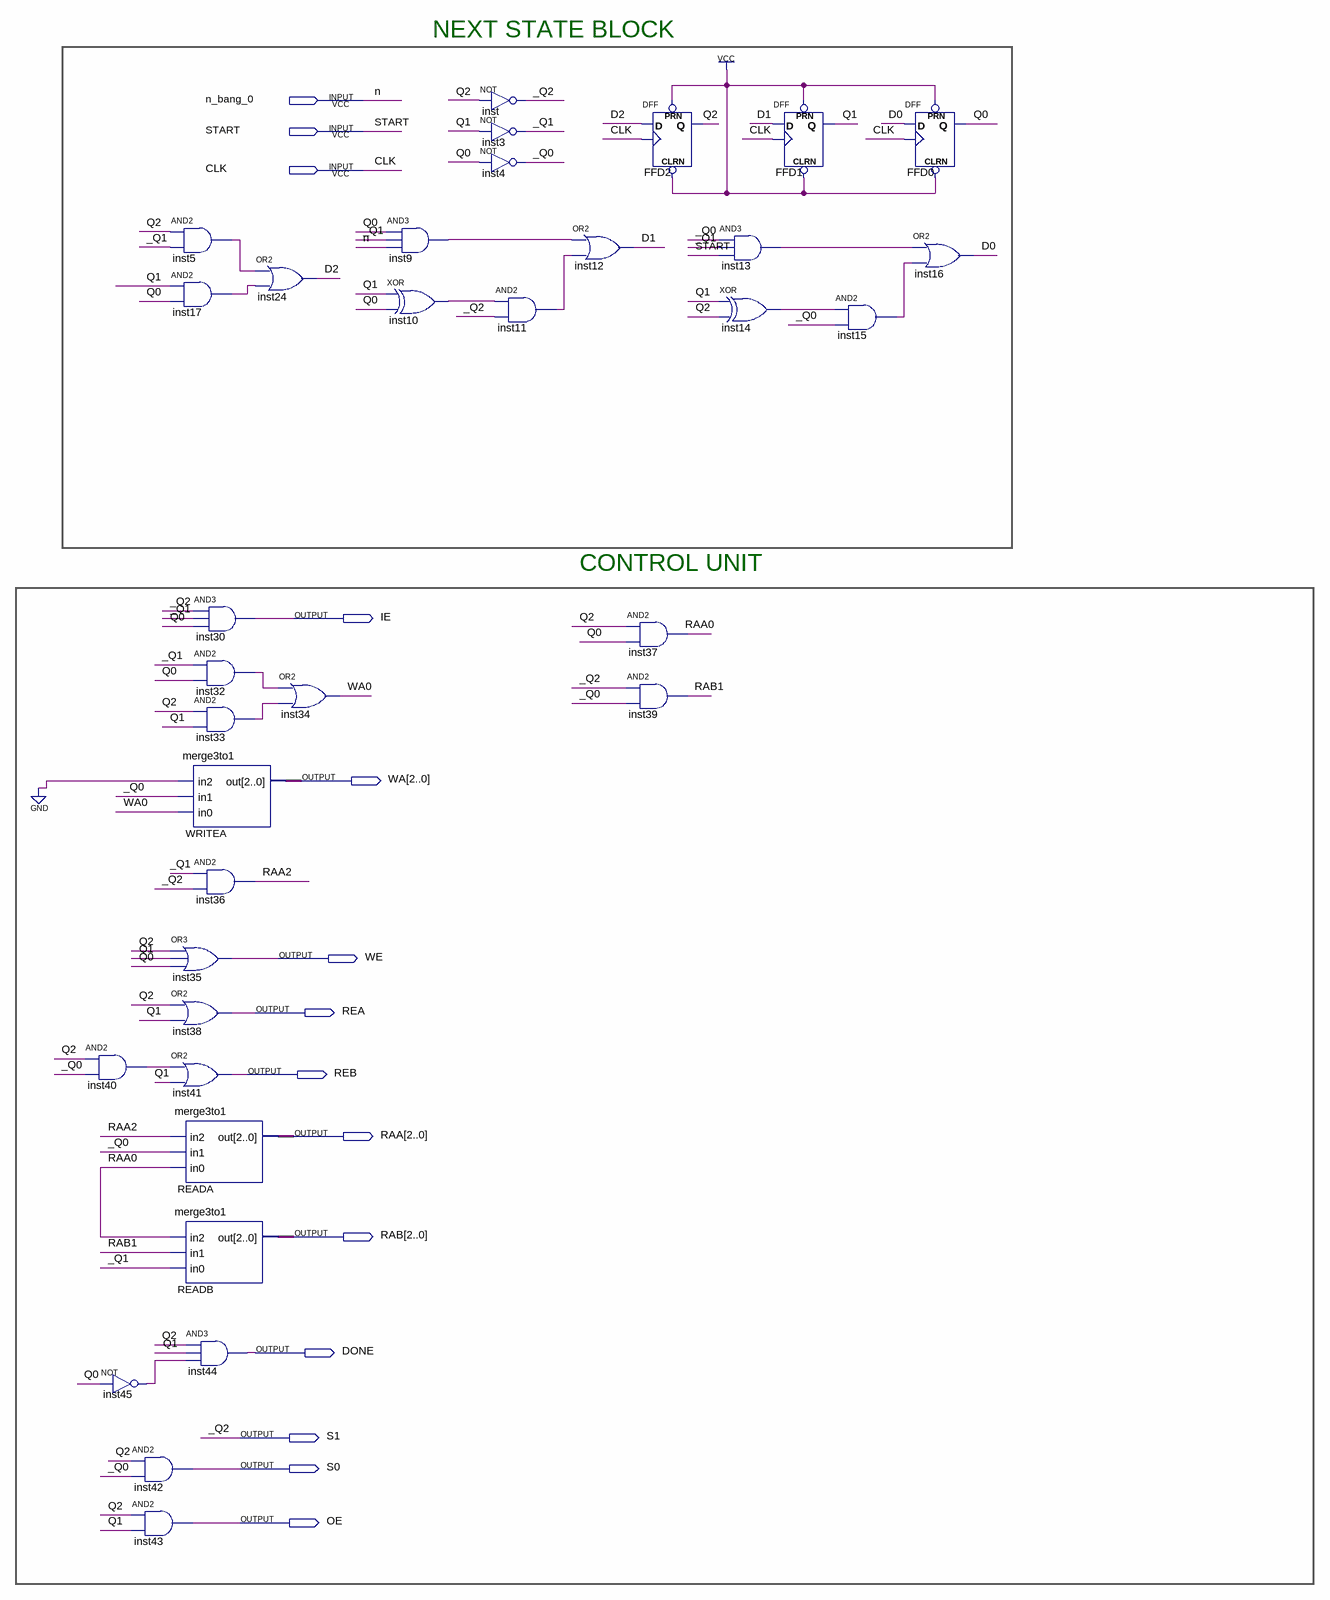
[diagram p0: schematic sheet]
// Quartus schematic NextState.bdf as structural Verilog: 35 symbols, 14 pins
module NextState (
  input  n_bang_0,
  input  START,
  input  CLK,
  output IE,
  output [2:0] WA,
  output WE,
  output REA,
  output REB,
  output [2:0] RAA,
  output [2:0] RAB,
  output DONE,
  output S1,
  output S0,
  output OE
);

  wire _Q0, _Q1, D0, D1, D2, inst5_out, inst9_out, inst10_out, inst11_out, inst13_out, inst14_out,
       inst15_out, inst17_out, inst32_out, inst33_out, inst40_out, inst45_out, Q0, Q1, Q2;

  and inst40 (inst40_out, Q2, _Q0);
  not inst45 (inst45_out, Q0);
  and inst42 (S0, Q2, _Q0);
  and inst43 (OE, Q2, Q1);
  and inst5 (inst5_out, Q2, _Q1);
  and inst17 (inst17_out, Q1, Q0);
  and inst30 (IE, S1, _Q1, Q0);
  and inst32 (inst32_out, _Q1, Q0);
  and inst33 (inst33_out, Q2, Q1);
  merge3to1 WRITEA (.in2(1'b0), .in1(_Q0), .in0(WA[0]), .out(WA));
  and inst36 (RAA[2], _Q1, S1);
  or inst35 (WE, Q2, Q1, Q0);
  or inst38 (REA, Q2, Q1);
  or inst41 (REB, inst40_out, Q1);
  merge3to1 READA (.in2(RAA[2]), .in1(_Q0), .in0(RAA[0]), .out(RAA));
  merge3to1 READB (.in2(RAA[0]), .in1(RAB[1]), .in0(_Q1), .out(RAB));
  and inst44 (DONE, Q2, Q1, inst45_out);
  or inst24 (D2, inst5_out, inst17_out);
  or inst34 (WA[0], inst32_out, inst33_out);
  and inst9 (inst9_out, Q0, _Q1, n_bang_0);
  xor inst10 (inst10_out, Q1, Q0);
  not inst (S1, Q2);
  not inst3 (_Q1, Q1);
  not inst4 (_Q0, Q0);
  and inst11 (inst11_out, inst10_out, S1);
  or inst12 (D1, inst9_out, inst11_out);
  and inst37 (RAA[0], Q2, Q0);
  and inst39 (RAB[1], S1, _Q0);
  DFF FFD2 (.CLRN(1'b1), .CLK(CLK), .D(D2), .PRN(1'b1), .Q(Q2));
  and inst13 (inst13_out, _Q0, _Q1, START);
  xor inst14 (inst14_out, Q1, Q2);
  DFF FFD1 (.CLRN(1'b1), .CLK(CLK), .D(D1), .PRN(1'b1), .Q(Q1));
  and inst15 (inst15_out, inst14_out, _Q0);
  DFF FFD0 (.CLRN(1'b1), .CLK(CLK), .D(D0), .PRN(1'b1), .Q(Q0));
  or inst16 (D0, inst13_out, inst15_out);

  // Other names for the same wires on the sheet: _Q2 = S1; n = n_bang_0

  // Notes on the sheet:
  //   NEXT STATE BLOCK
  //   CONTROL UNIT
endmodule
